# Altium schematic sheet rev02_23.SchDoc
size 282 x 200 mm
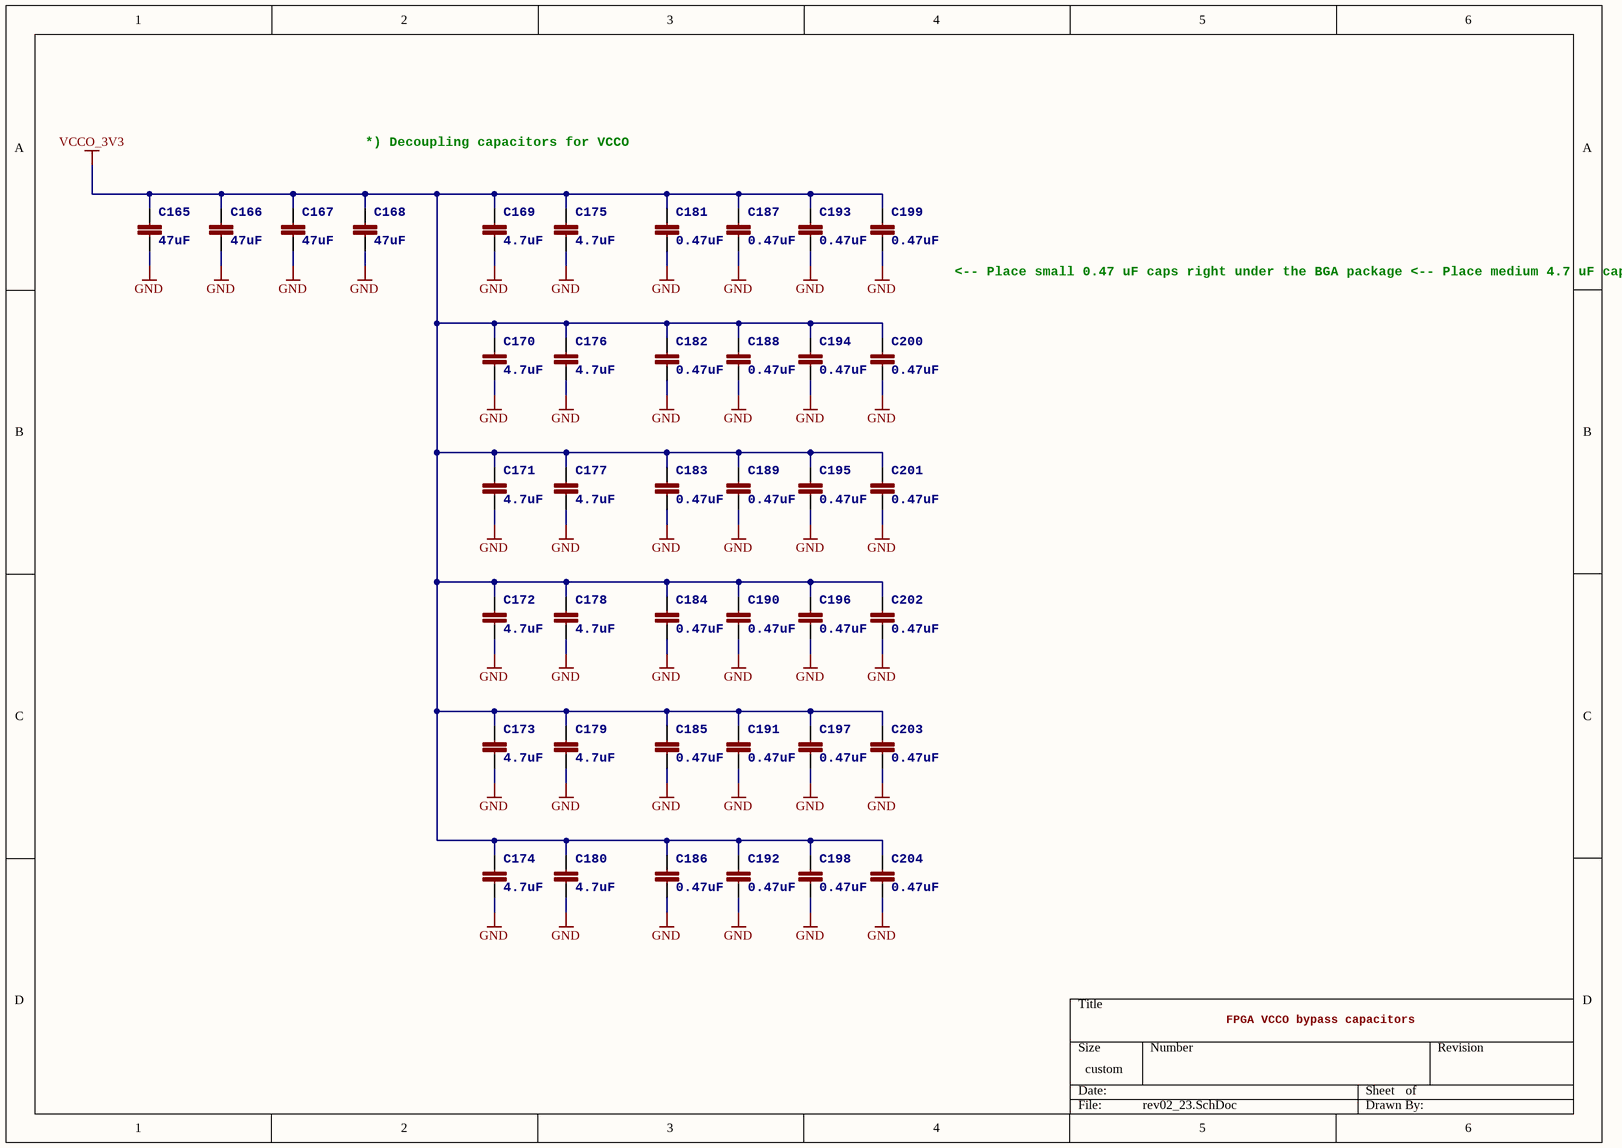
[diagram p0: rev02_23.SchDoc]

## Parts
C165  value 47uF  >NAME: C165  [C_1210]  (hidden comment: GRM32ER70J476ME20L)
C166  value 47uF  >NAME: C166  [C_1210]  (hidden comment: GRM32ER70J476ME20L)
C167  value 47uF  >NAME: C167  [C_1210]  (hidden comment: GRM32ER70J476ME20L)
C168  value 47uF  >NAME: C168  [C_1210]  (hidden comment: GRM32ER70J476ME20L)
C169  value 4.7uF  >NAME: C169  [C_0805]  (hidden comment: GRM21BR71A475KA73L)
C170  value 4.7uF  >NAME: C170  [C_0805]  (hidden comment: GRM21BR71A475KA73L)
C171  value 4.7uF  >NAME: C171  [C_0805]  (hidden comment: GRM21BR71A475KA73L)
C172  value 4.7uF  >NAME: C172  [C_0805]  (hidden comment: GRM21BR71A475KA73L)
C173  value 4.7uF  >NAME: C173  [C_0805]  (hidden comment: GRM21BR71A475KA73L)
C174  value 4.7uF  >NAME: C174  [C_0805]  (hidden comment: GRM21BR71A475KA73L)
C175  value 4.7uF  >NAME: C175  [C_0805]  (hidden comment: GRM21BR71A475KA73L)
C176  value 4.7uF  >NAME: C176  [C_0805]  (hidden comment: GRM21BR71A475KA73L)
C177  value 4.7uF  >NAME: C177  [C_0805]  (hidden comment: GRM21BR71A475KA73L)
C178  value 4.7uF  >NAME: C178  [C_0805]  (hidden comment: GRM21BR71A475KA73L)
C179  value 4.7uF  >NAME: C179  [C_0805]  (hidden comment: GRM21BR71A475KA73L)
C180  value 4.7uF  >NAME: C180  [C_0805]  (hidden comment: GRM21BR71A475KA73L)
C181  value 0.47uF  >NAME: C181  [C_0402]  (hidden comment: GRM155R61A474KE15D)
C182  value 0.47uF  >NAME: C182  [C_0402]  (hidden comment: GRM155R61A474KE15D)
C183  value 0.47uF  >NAME: C183  [C_0402]  (hidden comment: GRM155R61A474KE15D)
C184  value 0.47uF  >NAME: C184  [C_0402]  (hidden comment: GRM155R61A474KE15D)
C185  value 0.47uF  >NAME: C185  [C_0402]  (hidden comment: GRM155R61A474KE15D)
C186  value 0.47uF  >NAME: C186  [C_0402]  (hidden comment: GRM155R61A474KE15D)
C187  value 0.47uF  >NAME: C187  [C_0402]  (hidden comment: GRM155R61A474KE15D)
C188  value 0.47uF  >NAME: C188  [C_0402]  (hidden comment: GRM155R61A474KE15D)
C189  value 0.47uF  >NAME: C189  [C_0402]  (hidden comment: GRM155R61A474KE15D)
C190  value 0.47uF  >NAME: C190  [C_0402]  (hidden comment: GRM155R61A474KE15D)
C191  value 0.47uF  >NAME: C191  [C_0402]  (hidden comment: GRM155R61A474KE15D)
C192  value 0.47uF  >NAME: C192  [C_0402]  (hidden comment: GRM155R61A474KE15D)
C193  value 0.47uF  >NAME: C193  [C_0402]  (hidden comment: GRM155R61A474KE15D)
C194  value 0.47uF  >NAME: C194  [C_0402]  (hidden comment: GRM155R61A474KE15D)
C195  value 0.47uF  >NAME: C195  [C_0402]  (hidden comment: GRM155R61A474KE15D)
C196  value 0.47uF  >NAME: C196  [C_0402]  (hidden comment: GRM155R61A474KE15D)
C197  value 0.47uF  >NAME: C197  [C_0402]  (hidden comment: GRM155R61A474KE15D)
C198  value 0.47uF  >NAME: C198  [C_0402]  (hidden comment: GRM155R61A474KE15D)
C199  value 0.47uF  >NAME: C199  [C_0402]  (hidden comment: GRM155R61A474KE15D)
C200  value 0.47uF  >NAME: C200  [C_0402]  (hidden comment: GRM155R61A474KE15D)
C201  value 0.47uF  >NAME: C201  [C_0402]  (hidden comment: GRM155R61A474KE15D)
C202  value 0.47uF  >NAME: C202  [C_0402]  (hidden comment: GRM155R61A474KE15D)
C203  value 0.47uF  >NAME: C203  [C_0402]  (hidden comment: GRM155R61A474KE15D)
C204  value 0.47uF  >NAME: C204  [C_0402]  (hidden comment: GRM155R61A474KE15D)

## Nets
GND: C165.2 C166.2 C167.2 C168.2 C169.2 C170.2 C171.2 C172.2 C173.2 C174.2 C175.2 C176.2 C177.2 C178.2 C179.2 C180.2 C181.2 C182.2 C183.2 C184.2 C185.2 C186.2 C187.2 C188.2 C189.2 C190.2 C191.2 C192.2 C193.2 C194.2 C195.2 C196.2 C197.2 C198.2 C199.2 C200.2 C201.2 C202.2 C203.2 C204.2
VCCO_3V3: C165.1 C166.1 C167.1 C168.1 C169.1 C170.1 C171.1 C172.1 C173.1 C174.1 C175.1 C176.1 C177.1 C178.1 C179.1 C180.1 C181.1 C182.1 C183.1 C184.1 C185.1 C186.1 C187.1 C188.1 C189.1 C190.1 C191.1 C192.1 C193.1 C194.1 C195.1 C196.1 C197.1 C198.1 C199.1 C200.1 C201.1 C202.1 C203.1 C204.1

## Notes on the sheet
- *) Decoupling capacitors for VCCO
- <-- Place small 0.47 uF caps right under the BGA package
  <-- Place medium 4.7 uF caps very close to the BGA package
  <-- Place large 47 uF caps not far from the BGA package
  <-- Place one of four 47 uF caps on every side of the BGA p.
  <-- Distribute six sets of caps among six FPGA I/O banks
- FPGA VCCO bypass capacitors

## Library data of the parts
C165-C168 = C-EUC1210: 1210 CAPACITOR X5R 6.3V; RATED_VOLTAGE: 16V; TOLERANCE: 20%; DIELECTRIC: X5R
C169-C180 = C-EUC0603: 0805 CAPACITOR; DIELECTRIC: X5R; RATED_VOLTAGE: 16V; TOLERANCE: 10%
C181-C204 = C-EUC0402: 0402 CAPACITOR; DIELECTRIC: X5R; RATED_VOLTAGE: 6.3V; TOLERANCE: 10%